# Altium schematic sheet TOP.SchDoc
size Letter; Organization: Penn Electric Racing; Address1: 220 S. 33rd St; Address2: Towne Bldg B11; Address3: Philadelpia, PA 19104; Address4: USA
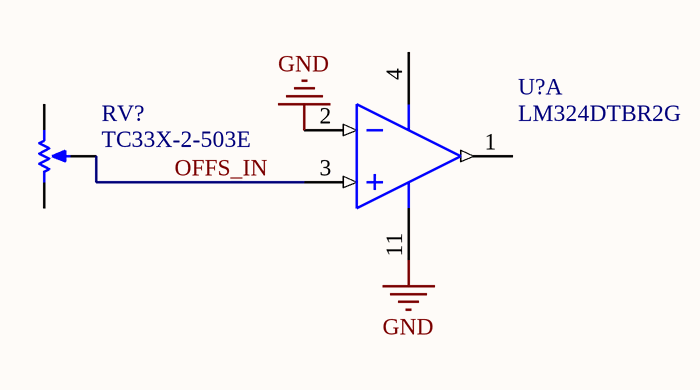
[diagram p0: TOP.SchDoc]

## Parts
RV?  TC33X-2-503E  [TC33X]
U?  LM324DTBR2G  [ONSC-TSSOP-14-948G-01_V]  (part A of 4)

## Nets
GND: U?.2(IN1-) U?.11(VEE/GND)
OFFS_IN: RV?.2(WIPER) U?.3(IN1+)

Not connected (* = marked no-connect by the designer): RV? 1(CCW) 3(CW); U? 1(OUT1) 4(VCC)

## Notes on the sheet
- Title:
- Size:
- Date:
- Desc:
- Letter
- Auth:
- Sheet
- Proj:
- *
- of
- www.uvmaero.org
- File:

## Library data of the parts
RV? = TC33X-2-503E: 50 kOhms 0.1W, 1/10W J Lead Surface Mount Trimmer Potentiometer Cermet 1 Turn Top Adjustment; Manufacturer: Bourns; Max Power Dissipation: 100mW; Number of Turns: 1; Resistance: 50kR; Temperature Coefficient: 250ppm/°C; Tolerance: 25%; Voltage Rating (DC): 50V; ComponentLink2URL: https://www.ttelectronics.com/TTElectronics/media/ProductFiles/Trimmers/Datasheets/67.pdf; ComponentLink2Description: Datasheet; Category: Variable Resistors and Potentiometers; Color: Silver; Composition: Cermet; Depth: 3.8mm; Height: 1.2mm; Lead Free: Contains Lead; Length: 3.8mm; Manufacturer Part Number: TC33X-2-503E; Max Operating Temperature: 100°C; Military Standard: Not; Min Operating Temperature: -40°C; Mount: Surface Mount; Package Quantity: 2500; Packaging: Tape and Reel; Power Rating: 100mW; Radiation Hardening: No; REACH SVHC: No SVHC; Termination: Foot Print; Weight: 29.4mg; Width: 0.118inch; Supplier 1: Digi-Key; Supplier Part Number 1: TC33X-503ECT-ND
U? = CMP-1310-00405-1: Single Supply Quad Operational Amplifier, 3 to 32 V, 0 to 70 degC, 14-Pin TSSOP, Pb-Free, Tape and Reel; Manufacturer: On Semiconductor; VCC Max (V): 32; VCC Min (V): 3; Mounting Technology: Surface Mount; PackageDescription: 14-Pin Small Outline Package, Body 5 x 4.4 mm, Pitch 0.65 mm; PackageReference: TSSOP-14-948G-01; RoHS: TRUE; DatasheetVersion: Rev. 25; ComponentLink3Description: Package Specification; Packing: Tape and Reel; ComponentLink3URL: http://www.onsemi.com/pub_link/Collateral/948G-01.PDF; PartNumber: LM324DTBR2G; PackageVersion: Rev. B, 10/2006; ComponentLink1URL: http://www.onsemi.com/; ComponentLink1Description: Manufacturer URL; ComponentLink2Description: Datasheet; ComponentLink2URL: http://www.onsemi.cn/pub_link/Collateral/LM324-D.PDF